# Altium schematic sheet LPCB225 - CLOCK.SchDoc
size A3; Address1: Factory 10; Address2: 9-13 Dingley Avenue, Dandeong, VICTORIA 3175, AUSTRALIA; DocumentNumber: 2; Revision: 1; SheetNumber: 2; SheetTotal: 6; Lockie__PCB_SUB_ASSEMBLY: Clock Generator; Lockie__PCB_ASSEMBLY: Module; Lockie__LDL: LPCB225; Lockie__PCB_DESCRIPTION: BMS Module
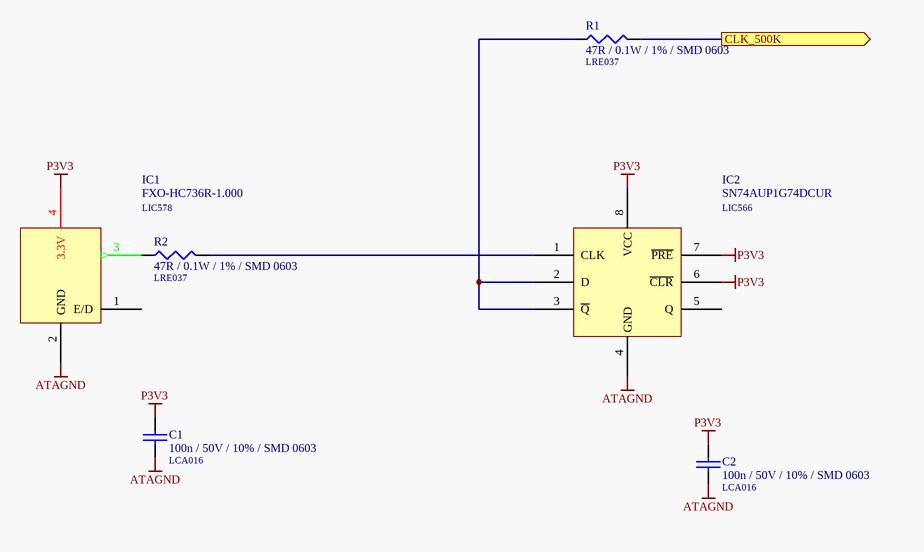
[diagram p0: LPCB225 - CLOCK.SchDoc]

## Parts
C1  100n / 50V / 10% / SMD 0603  LDL_NUMBER: LCA016  [LFP011__CC1608-0603-IPC7351_B]
C2  100n / 50V / 10% / SMD 0603  LDL_NUMBER: LCA016  [LFP011__CC1608-0603-IPC7351_B]
IC1  FXO-HC736R-1.000  LDL_NUMBER: LIC578  [LFP132__SMO-190]
IC2  SN74AUP1G74DCUR  LDL_NUMBER: LIC566  [LFP052__DCU-S-PDSO-G8]
R1  47R / 0.1W / 1% / SMD 0603  LDL_NUMBER: LRE037  [LFP020__CR1608-0603-IPC7351_B]
R2  47R / 0.1W / 1% / SMD 0603  LDL_NUMBER: LRE037  [LFP020__CR1608-0603-IPC7351_B]

## Ports
CLK_500K (out)

## Nets
ATAGND: C1.2 C2.2 IC1.2(GND) IC2.4(GND)
P3V3: C1.1 C2.1 IC1.4(3.3V) IC2.6(~{CLR}) IC2.7(~{PRE}) IC2.8(VCC)
CLK_500K: R1.2 ; port CLK_500K
NetIC1_3: IC1.3(OUT) R2.1
NetIC2_1: IC2.1(CLK) R2.2
NetIC2_2: IC2.2(D) IC2.3(~{Q}) R1.1

Not connected (* = marked no-connect by the designer): IC1 1(E/D); IC2 5(Q)

## Notes on the sheet
- PCB COMPONENT DESCRIPTION
- LDL NUMBER
- Assembly Details
- Size
- Drawing File Name
- Revision
- http://rloop.org
- Scale
- A3
- Sheet Details
- N.T.S
- Sheet:
- Of:

## Library data of the parts
C1 C2 = 100n / 50V / 10% / SMD 0603: Capacitor, Ceramic Chip, 100nF (0.1uF), 50V, 5%, SMD 0603 [LCA016]; FMEDA__OPERATING__VOLTAGE_MIN: 0; FMEDA__OPERATING__VOLTAGE_MAX: 3.3; FMEDA__OPERATING__TEMP_MIN: -20; FMEDA__OPERATING__TEMP_TYP: 27; FMEDA__OPERATING__TEMP_MAX: 50; FMEDA__CHANNEL: COM; Value: 100n; FMEDA__FUNCTION_IN_SYSTEM: *; FMEDA__OPERATING__VOLTAGE_TYP: 3.3
IC1 = FXO-HC736R-1.000: IC, Oscillator Module, 1MHz, 3.3V, SMD [LIC578]; FMEDA__OPERATING__TEMP_MAX: 50; FMEDA__OPERATING__TEMP_MIN: -20; FMEDA__OPERATING__TEMP_TYP: 27; FMEDA__OPERATING__VOLTAGE_MAX: 3.3; FMEDA__OPERATING__VOLTAGE_MIN: 0; FMEDA__CHANNEL: COM; FMEDA__OPERATING__VOLTAGE_TYP: 3.3; FMEDA__FUNCTION_IN_SYSTEM: *
IC2 = SN74AUP1G74DCUR: IC, Flip Flop, SMD SOP8 [LIC566]; FMEDA__OPERATING__TEMP_MAX: 85; FMEDA__OPERATING__TEMP_MIN: -40; FMEDA__OPERATING__TEMP_TYP: 27; FMEDA__OPERATING__VOLTAGE_MAX: 3.6; FMEDA__OPERATING__VOLTAGE_MIN: 0.8; FMEDA__OPERATING__VOLTAGE_TYP: 0; FMEDA__CHANNEL: COM; FMEDA__FUNCTION_IN_SYSTEM: *
R1 R2 = 47R / 0.1W / 1% / SMD 0603: Resistor, Ceramic Chip, 47R, 0.1W, 1%, SMD 0603 [LRE037]; VALUE: 47; FMEDA__OPERATING__POWER_MAX: 0; FMEDA__OPERATING__TEMP_MAX: 50; FMEDA__OPERATING__TEMP_MIN: -20; FMEDA__OPERATING__TEMP_TYP: 27; FMEDA__CHANNEL: COM; FMEDA__OPERATING__POWER_MIN: 0; FMEDA__OPERATING__VOLTAGE_MAX: 0; FMEDA__OPERATING__VOLTAGE_MIN: 0; FMEDA__OPERATING__VOLTAGE_TYP: 0; FMEDA__FUNCTION_IN_SYSTEM: *